# Altium project HSens.PrjPcb
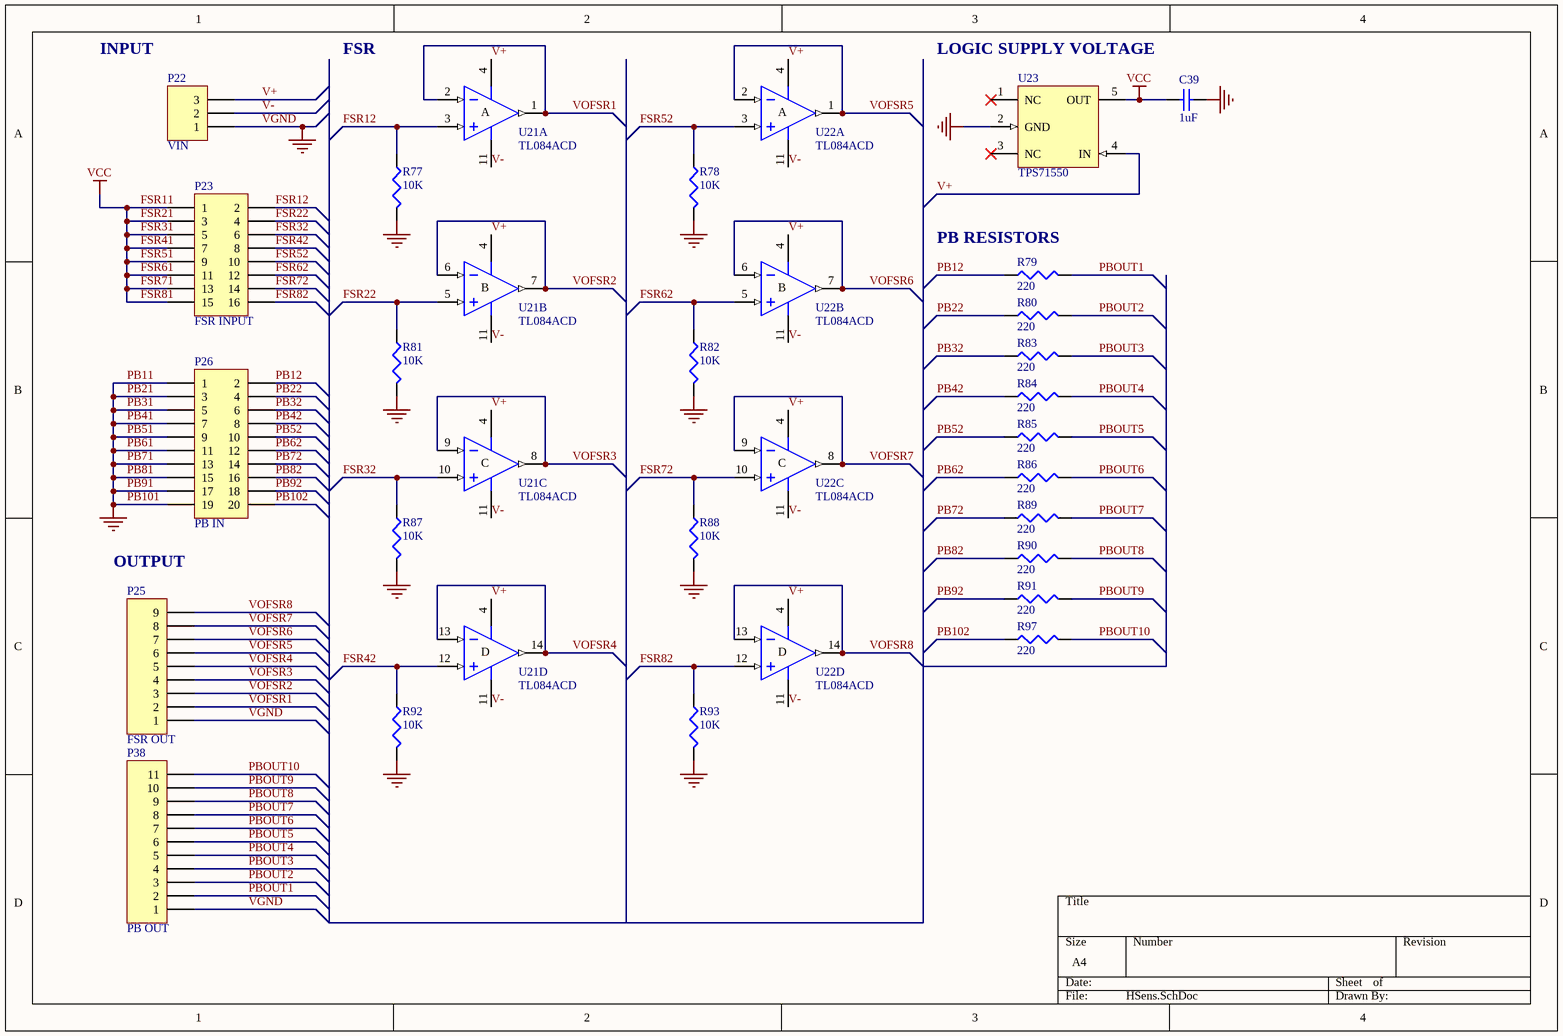
[diagram p0: HSens.SchDoc]
1 sheet, 27 parts. Net scope: global (net labels, ports and power ports of the same name join across sheets).
Board file: HSens.PcbDoc

## Sheet HSens.SchDoc
size A4

### Parts
C39  value 1uF  [CAPC2012M]  (hidden comment: Cap Semi)
P22  VIN  [AZUL5-3]
P23  FSR INPUT  [HDR2X8]
P25  FSR OUT  [HDR1X9H]
P26  PB IN  [HDR2X10]
P38  PB OUT  [HDR1X11H]
R77  value 10K  [RESC3225M]  (hidden comment: Res3)
R78  value 10K  [RESC3225M]  (hidden comment: Res3)
R79  value 220  [RESC3225M]  (hidden comment: Res3)
R80  value 220  [RESC3225M]  (hidden comment: Res3)
R81  value 10K  [RESC3225M]  (hidden comment: Res3)
R82  value 10K  [RESC3225M]  (hidden comment: Res3)
R83  value 220  [RESC3225M]  (hidden comment: Res3)
R84  value 220  [RESC3225M]  (hidden comment: Res3)
R85  value 220  [RESC3225M]  (hidden comment: Res3)
R86  value 220  [RESC3225M]  (hidden comment: Res3)
R87  value 10K  [RESC3225M]  (hidden comment: Res3)
R88  value 10K  [RESC3225M]  (hidden comment: Res3)
R89  value 220  [RESC3225M]  (hidden comment: Res3)
R90  value 220  [RESC3225M]  (hidden comment: Res3)
R91  value 220  [RESC3225M]  (hidden comment: Res3)
R92  value 10K  [RESC3225M]  (hidden comment: Res3)
R93  value 10K  [RESC3225M]  (hidden comment: Res3)
R97  value 220  [RESC3225M]  (hidden comment: Res3)
U21  TL084ACD  [SO14_N]  (parts A,B,C,D of 4)
U22  TL084ACD  [SO14_N]  (parts A,B,C,D of 4)
U23  TPS71550  [SOT353-5L]

### Nets
FSR11: C39.1 P23.1 P23.3 P23.5 P23.7 P23.9 P23.11 P23.13 P23.15 U23.5(OUT)  [also labelled FSR21, FSR31, FSR41, FSR51, FSR61, FSR71, FSR81, VCC]
PB101: C39.2 P22.1 P25.1 P26.1 P26.3 P26.5 P26.7 P26.9 P26.11 P26.13 P26.15 P26.17 P26.19 P38.1 R77.2 R78.2 R81.2 R82.2 R87.2 R88.2 R92.2 R93.2 U23.2(GND)  [also labelled GND, PB11, PB21, PB31, PB41, PB51, PB61, PB71, PB81, PB91, VGND]
FSR12: P23.2 R77.1 U21.3(IN+)
FSR22: P23.4 R81.1 U21.5(IN+)
FSR32: P23.6 R87.1 U21.10(IN+)
FSR42: P23.8 R92.1 U21.12(IN+)
FSR52: P23.10 R78.1 U22.3(IN+)
FSR62: P23.12 R82.1 U22.5(IN+)
FSR72: P23.14 R88.1 U22.10(IN+)
FSR82: P23.16 R93.1 U22.12(IN+)
PB12: P26.2 R79.1
PB22: P26.4 R80.1
PB32: P26.6 R83.1
PB42: P26.8 R84.1
PB52: P26.10 R85.1
PB62: P26.12 R86.1
PB72: P26.14 R89.1
PB82: P26.16 R90.1
PB92: P26.18 R91.1
PB102: P26.20 R97.1
PBOUT1: P38.2 R79.2
PBOUT2: P38.3 R80.2
PBOUT3: P38.4 R83.2
PBOUT4: P38.5 R84.2
PBOUT5: P38.6 R85.2
PBOUT6: P38.7 R86.2
PBOUT7: P38.8 R89.2
PBOUT8: P38.9 R90.2
PBOUT9: P38.10 R91.2
PBOUT10: P38.11 R97.2
V+: P22.3 U21.4(V+) U22.4(V+) U23.4(IN)
V-: P22.2 U21.11(V-) U22.11(V-)
VOFSR1: P25.2 U21.1(OUT) U21.2(IN-)
VOFSR2: P25.3 U21.6(IN-) U21.7(OUT)
VOFSR3: P25.4 U21.8(OUT) U21.9(IN-)
VOFSR4: P25.5 U21.13(IN-) U21.14(OUT)
VOFSR5: P25.6 U22.1(OUT) U22.2(IN-)
VOFSR6: P25.7 U22.6(IN-) U22.7(OUT)
VOFSR7: P25.8 U22.8(OUT) U22.9(IN-)
VOFSR8: P25.9 U22.13(IN-) U22.14(OUT)

Not connected (* = marked no-connect by the designer): U23 1(NC)* 3(NC)*

### Notes on the sheet
- INPUT
- FSR
- (near U23) LOGIC SUPPLY VOLTAGE
- (near R79) PB RESISTORS
- OUTPUT
- (in symbol TL084ACD, part A) A
- (in symbol TL084ACD, part B) B
- (in symbol TL084ACD, part C) C
- (in symbol TL084ACD, part D) D

### Library data of the parts
C39 = Cap Semi: Capacitor (Semiconductor SIM Model); Published: 8-Jun-2000; LatestRevisionDate: 29-May-2009; LatestRevisionNote: IPC-7351 Footprint Added.; PackageReference: C1206; Publisher: Altium Limited; PackageDescription: Chip Capacitor
P22 = Header 3: Header, 3-Pin; LatestRevisionDate: 17-Jul-2002; LatestRevisionNote: Re-released for DXP Platform.; Publisher: Altium Limited
P23 = Header 8X2: Header, 8-Pin, Dual row; LatestRevisionDate: 17-Jul-2002; LatestRevisionNote: Re-released for DXP Platform.; Publisher: Altium Limited
P25 = Header 9H: Header, 9-Pin, Right Angle; LatestRevisionDate: 17-Jul-2002; LatestRevisionNote: Re-released for DXP Platform.; Publisher: Altium Limited
P26 = Header 10X2: Header, 10-Pin, Dual row; LatestRevisionDate: 17-Jul-2002; LatestRevisionNote: Re-released for DXP Platform.; Publisher: Altium Limited
P38 = Header 11H: Header, 11-Pin, Right Angle; LatestRevisionDate: 17-Jul-2002; LatestRevisionNote: Re-released for DXP Platform.; Publisher: Altium Limited
R77-R93 R97 = Res3: Resistor; Published: 8-Jun-2000; LatestRevisionDate: 29-May-2009; LatestRevisionNote: IPC-7351 Footprint Added.; PackageReference: J1-0603; Publisher: Altium Limited; PackageDescription: Chip Resistor
U21 U22 = TL084ACD: General-Purpose J-FET Quad Operational Amplifier; Published: 24-Aug-2001; LatestRevisionDate: 13-Apr-2006; LatestRevisionNote: IPC-7351 Footprint Added.; DatasheetVersion: Jan-1999; PackageVersion: Sep-1998; PackageReference: SO14; Publisher: Altium Limited; PackageDescription: 14-Pin Small Outline Integrated Circuit 1.27 mm Pitch; Code_IPC: SOIC127P600-14; ComponentLink1Description: Manufacturer Link; ComponentLink1URL: http://www.st.com/; ComponentLink2Description: Datasheet; ComponentLink2URL: http://www.st.com/stonline/products/literature/ds/2301/tl084.pdf